# EAGLE design efm32core (EAGLE 6.5.0)
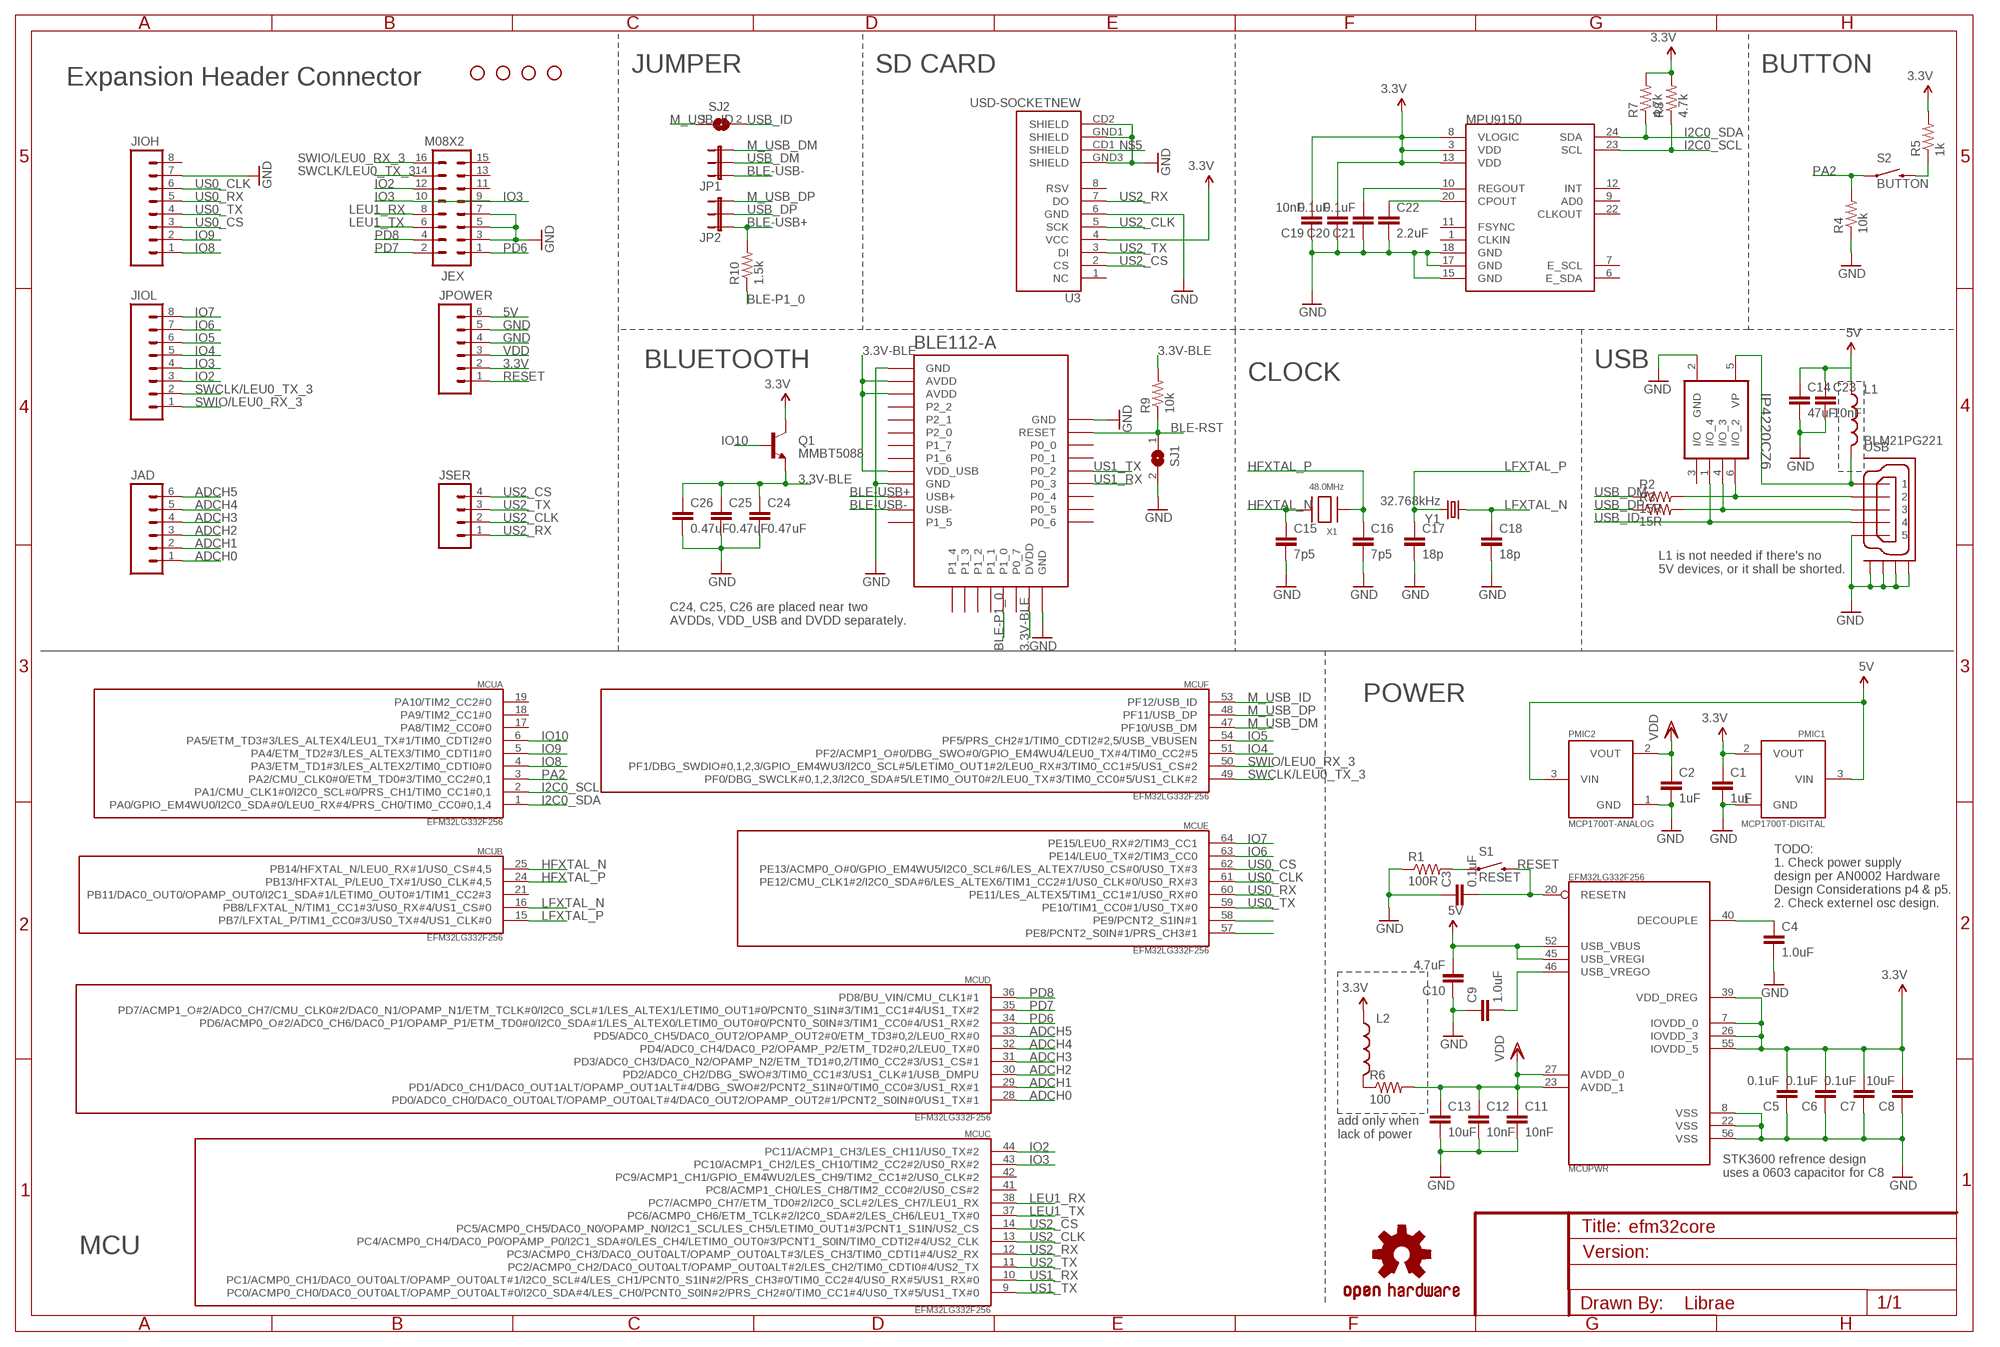
[diagram p0: schematic, sheet 1]

## Parts
BLE112-A  SF-BLUEGIGA_BLE112-A-VISUAL  [SF-BLUEGIGA_BLE112-A]
C1  1uF  10UF-6.3V-20%(1206)  [1206]
C2  1uF  10UF-6.3V-20%(1206)  [1206]
C3  0.1uF  0.1UF-25V-5%(0603)  [0603-CAP]
C4  1.0uF  1.0UF-16V-10%(0603)  [0603-CAP]
C5  0.1uF  0.1UF-25V-5%(0603)  [0603-CAP]
C6  0.1uF  0.1UF-25V-5%(0603)  [0603-CAP]
C7  0.1uF  0.1UF-25V-5%(0603)  [0603-CAP]
C8  10uF  10UF-6.3V-20%(1206)  [1206]
C9  1.0uF  1.0UF-16V-10%(0603)  [0603-CAP]
C10  4.7uF  4.7UF-6.3V-10%(0603)0603  [0603-CAP]
C11  10nF  10NF/10000PF-50V-10%(0603)  [0603-CAP]
C12  10nF  10NF/10000PF-50V-10%(0603)  [0603-CAP]
C13  10uF  10UF-6.3V-20%(1206)  [1206]
C14  47uF  10UF-6.3V-20%(1206)  [1206]
C15  7p5  9.0PF-50V-10%(0603)  [0603-CAP]
C16  7p5  9.0PF-50V-10%(0603)  [0603-CAP]
C17  18p  9.0PF-50V-10%(0603)  [0603-CAP]
C18  18p  9.0PF-50V-10%(0603)  [0603-CAP]
C19  10nF  10NF/10000PF-50V-10%(0603)  [0603-CAP]
C20  0.1uF  0.1UF-25V(+80/-20%)(0603)  [0603-CAP]
C21  0.1uF  0.1UF-25V(+80/-20%)(0603)  [0603-CAP]
C22  2.2uF  2.2UF-10V-20%(0603)  [0603-CAP]
C23  10nF  10NF/10000PF-50V-10%(0603)  [0603-CAP]
C24  0.47uF  10NF/10000PF-50V-10%(0603)  [0603-CAP]
C25  0.47uF  10NF/10000PF-50V-10%(0603)  [0603-CAP]
C26  0.47uF  10NF/10000PF-50V-10%(0603)  [0603-CAP]
IP4220CZ6  IP4220CZ6SSOT-6  [SOT95P275X110-6N]
JAD  M06SIP  [1X06]
JEX  M08X2  [2X8]
JIOH  M081X08  [1X08]
JIOL  M081X08  [1X08]
JP1  JUMPER-3SMD  [SJ_3]
JP2  JUMPER-3SMD  [SJ_3]
JPOWER  M06SIP  [1X06]
JSER  M041.27MM  [1X04-1.27MM]
L1  BLM21PG221  INDUCTOR0805  [0805]
L2  INDUCTOR0603  [0603]
LOGO1  OSHW-LOGOL  [OSHW-LOGO-L]
MCU  EFM32LG332F256  [QFP64]
MPU9150  MPU-9150QFN-24-NP  [QFN-24-NP]
PMIC1  MCP1700T-DIGITAL  MCP1700T  [SOT23]
PMIC2  MCP1700T-ANALOG  MCP1700T  [SOT23]
Q1  MMBT5088  TRANSISTOR_NPNMMBT5088  [SOT23]
R1  100R  100OHM1/10W1%(0603)  [0603-RES]
R2  15R  100-1%  [0603-RES]
R3  15R  100-1%  [0603-RES]
R4  10k  100OHM1/10W1%(0603)  [0603-RES]
R5  1k  100OHM1/10W1%(0603)  [0603-RES]
R6  100  100OHM1/10W1%(0603)  [0603-RES]
R7  4.7k  100OHM1/10W1%(0603)  [0603-RES]
R8  4.7k  100OHM1/10W1%(0603)  [0603-RES]
R9  10k  100-1%  [0603-RES]
R10  1.5k  100-1%  [0603-RES]
S1  RESET  PIXHAWK2_SWITCH-MOMENTARY-2  [PIXHAWK2_EVQP7J01K]
S2  BUTTON  PIXHAWK2_SWITCH-MOMENTARY-2  [PIXHAWK2_EVQP7J01K]
SJ1  JUMPER_SJ  [JUMPER_SJ]
SJ2  JUMPER_SJ  [JUMPER_SJ]
STANDOFF1  STAND-OFF  [STAND-OFF]
STANDOFF2  STAND-OFF  [STAND-OFF]
STANDOFF3  STAND-OFF  [STAND-OFF]
STANDOFF4  STAND-OFF  [STAND-OFF]
U3  USD-SOCKETNEW  [MICRO-SD-SOCKET-PP]
USB  PIXHAWK2_MOLEX-47346-0001  [PIXHAWK2_MOLEX-47346-0001]
X1  48.0MHz  XTALNX5032  [NX5032]
Y1  32.768kHz  CRYSTAL5X1.5  [CRYSTAL-32KHZ-SMD-MS3V-T1R]

## Nets
1: IP4220CZ6.5(VP) L1.2 USB.VBUS
3.3V: C1.1 C5.2 C6.2 C7.2 C8.2 C19.2 C20.2 JPOWER.2 L2.1 MCU.7(PWR:IOVDD_0) MCU.26(PWR:IOVDD_3) MCU.39(PWR:VDD_DREG) MCU.55(PWR:IOVDD_5) MPU9150.3(VDD) MPU9150.8(VLOGIC) MPU9150.13(VDD) PMIC1.2(VOUT) Q1.3(C) R5.2 R7.2 R8.2 U3.4(VCC)
3.3V-BLE: BLE112-A.AVDD1(AVDD) BLE112-A.AVDD2(AVDD) BLE112-A.DVDD BLE112-A.VDD_USB C24.1 C25.1 C26.1 Q1.2(E) R9.2
5V: C10.2 C14.1 C23.1 JPOWER.6 L1.1 MCU.45(PWR:USB_VREGI) MCU.52(PWR:USB_VBUS) PMIC1.3(VIN) PMIC2.3(VIN)
ADCH0: JAD.1 MCU.28(D:PD0/ADC0_CH0/DAC0_OUT0ALT/OPAMP_OUT0ALT#4/DAC0_OUT2/OPAMP_OUT2#1/PCNT2_S0IN#0/US1_TX#1)
ADCH1: JAD.2 MCU.29(D:PD1/ADC0_CH1/DAC0_OUT1ALT/OPAMP_OUT1ALT#4/DBG_SWO#2/PCNT2_S1IN#0/TIM0_CC0#3/US1_RX#1)
ADCH2: JAD.3 MCU.30(D:PD2/ADC0_CH2/DBG_SWO#3/TIM0_CC1#3/US1_CLK#1/USB_DMPU)
ADCH3: JAD.4 MCU.31(D:PD3/ADC0_CH3/DAC0_N2/OPAMP_N2/ETM_TD1#0,2/TIM0_CC2#3/US1_CS#1)
ADCH4: JAD.5 MCU.32(D:PD4/ADC0_CH4/DAC0_P2/OPAMP_P2/ETM_TD2#0,2/LEU0_TX#0)
ADCH5: JAD.6 MCU.33(D:PD5/ADC0_CH5/DAC0_OUT2/OPAMP_OUT2#0/ETM_TD3#0,2/LEU0_RX#0)
BLE-P1_0: BLE112-A.P1_0 R10.1
BLE-RST: BLE112-A.RESET R9.1 SJ1.1
BLE-USB+: BLE112-A.USB+ JP2.1 R10.2
BLE-USB-: BLE112-A.USB- JP1.1
GND: BLE112-A.GND1(GND) BLE112-A.GND2(GND) BLE112-A.GND3(GND) BLE112-A.GND4(GND) C1.2 C2.2 C3.1 C4.2 C5.1 C6.1 C7.1 C8.1 C9.1 C10.1 C11.2 C12.2 C13.2 C14.2 C15.2 C16.2 C17.2 C18.2 C19.1 C20.1 C21.1 C22.2 C23.2 C24.2 C25.2 C26.2 IP4220CZ6.2(GND) JEX.3 JEX.5 JEX.7 JIOH.7 JPOWER.4 JPOWER.5 MCU.8(PWR:VSS) MCU.22(PWR:VSS) MCU.56(PWR:VSS) MPU9150.15(GND) MPU9150.17(GND) MPU9150.18(GND) PMIC1.1(GND) PMIC2.1(GND) R1.1 R4.1 SJ1.2 U3.6(GND) U3.CD2(SHIELD) U3.GND1(SHIELD) U3.GND3(SHIELD) USB.GND USB.GND1 USB.GND2 USB.GND3 USB.GND4
HFXTAL_N: C15.1 MCU.25(B:PB14/HFXTAL_N/LEU0_RX#1/US0_CS#4,5) X1.P$2
HFXTAL_P: C16.1 MCU.24(B:PB13/HFXTAL_P/LEU0_TX#1/US0_CLK#4,5) X1.P$1
I2C0_SCL: MCU.2(A:PA1/CMU_CLK1#0/I2C0_SCL#0/PRS_CH1/TIM0_CC1#0,1) MPU9150.23(SCL) R8.1
I2C0_SDA: MCU.1(A:PA0/GPIO_EM4WU0/I2C0_SDA#0/LEU0_RX#4/PRS_CH0/TIM0_CC0#0,1,4) MPU9150.24(SDA) R7.1
IO2: JEX.12 JIOL.3 MCU.44(C:PC11/ACMP1_CH3/LES_CH11/US0_TX#2)
IO3: JEX.9 JEX.10 JIOL.4 MCU.43(C:PC10/ACMP1_CH2/LES_CH10/TIM2_CC2#2/US0_RX#2)
IO4: JIOL.5 MCU.51(F:PF2/ACMP1_O#0/DBG_SWO#0/GPIO_EM4WU4/LEU0_TX#4/TIM0_CC2#5)
IO5: JIOL.6 MCU.54(F:PF5/PRS_CH2#1/TIM0_CDTI2#2,5/USB_VBUSEN)
IO6: JIOL.7 MCU.63(E:PE14/LEU0_TX#2/TIM3_CC0)
IO7: JIOL.8 MCU.64(E:PE15/LEU0_RX#2/TIM3_CC1)
IO8: JIOH.1 MCU.4(A:PA3/ETM_TD1#3/LES_ALTEX2/TIM0_CDTI0#0)
IO9: JIOH.2 MCU.5(A:PA4/ETM_TD2#3/LES_ALTEX3/TIM0_CDTI1#0)
IO10: MCU.6(A:PA5/ETM_TD3#3/LES_ALTEX4/LEU1_TX#1/TIM0_CDTI2#0) Q1.1(B)
LEU1_RX: JEX.8 MCU.38(C:PC7/ACMP0_CH7/ETM_TD0#2/I2C0_SCL#2/LES_CH7/LEU1_RX)
LEU1_TX: JEX.6 MCU.37(C:PC6/ACMP0_CH6/ETM_TCLK#2/I2C0_SDA#2/LES_CH6/LEU1_TX#0)
LFXTAL_N: C18.1 MCU.16(B:PB8/LFXTAL_N/TIM1_CC1#3/US0_RX#4/US1_CS#0) Y1.X1
LFXTAL_P: C17.1 MCU.15(B:PB7/LFXTAL_P/TIM1_CC0#3/US0_TX#4/US1_CLK#0) Y1.X2
M_USB_DM: JP1.3 MCU.47(F:PF10/USB_DM)
M_USB_DP: JP2.3 MCU.48(F:PF11/USB_DP)
M_USB_ID: MCU.53(F:PF12/USB_ID) SJ2.1
N$4: L2.2 R6.1
N$5: U3.CD1(SHIELD)
N$6: R1.2 S1.A1
N$7: C4.1 MCU.40(PWR:DECOUPLE)
N$8: C9.2 MCU.46(PWR:USB_VREGO)
N$9: R5.1 S2.B3
N$11: MCU.57(E:PE8/PCNT2_S0IN#1/PRS_CH3#1)
N$12: C21.2 MPU9150.10(REGOUT)
N$13: IP4220CZ6.4(I/O_3) R3.2 USB.D+
N$14: IP4220CZ6.6(I/O_2) R2.2 USB.D-
N$15: C22.1 MPU9150.20(CPOUT)
N$16: MCU.58(E:PE9/PCNT2_S1IN#1)
PA2: MCU.3(A:PA2/CMU_CLK0#0/ETM_TD0#3/TIM0_CC2#0,1) R4.2 S2.A1
PD6: JEX.1 MCU.34(D:PD6/ACMP0_O#2/ADC0_CH6/DAC0_P1/OPAMP_P1/ETM_TD0#0/I2C0_SDA#1/LES_ALTEX0/LETIM0_OUT0#0/PCNT0_S0IN#3/TIM1_CC0#4/US1_RX#2)
PD7: JEX.2 MCU.35(D:PD7/ACMP1_O#2/ADC0_CH7/CMU_CLK0#2/DAC0_N1/OPAMP_N1/ETM_TCLK#0/I2C0_SCL#1/LES_ALTEX1/LETIM0_OUT1#0/PCNT0_S1IN#3/TIM1_CC1#4/US1_TX#2)
PD8: JEX.4 MCU.36(D:PD8/BU_VIN/CMU_CLK1#1)
RESET: C3.2 JPOWER.1 MCU.20(PWR:RESETN) S1.B3
SWCLK/LEU0_TX_3: JEX.14 JIOL.2 MCU.49(F:PF0/DBG_SWCLK#0,1,2,3/I2C0_SDA#5/LETIM0_OUT0#2/LEU0_TX#3/TIM0_CC0#5/US1_CLK#2)
SWIO/LEU0_RX_3: JEX.16 JIOL.1 MCU.50(F:PF1/DBG_SWDIO#0,1,2,3/GPIO_EM4WU3/I2C0_SCL#5/LETIM0_OUT1#2/LEU0_RX#3/TIM0_CC1#5/US1_CS#2)
US0_CLK: JIOH.6 MCU.61(E:PE12/CMU_CLK1#2/I2C0_SDA#6/LES_ALTEX6/TIM1_CC2#1/US0_CLK#0/US0_RX#3)
US0_CS: JIOH.3 MCU.62(E:PE13/ACMP0_O#0/GPIO_EM4WU5/I2C0_SCL#6/LES_ALTEX7/US0_CS#0/US0_TX#3)
US0_RX: JIOH.5 MCU.60(E:PE11/LES_ALTEX5/TIM1_CC1#1/US0_RX#0)
US0_TX: JIOH.4 MCU.59(E:PE10/TIM1_CC0#1/US0_TX#0)
US1_RX: BLE112-A.P0_3 MCU.10(C:PC1/ACMP0_CH1/DAC0_OUT0ALT/OPAMP_OUT0ALT#1/I2C0_SCL#4/LES_CH1/PCNT0_S1IN#2/PRS_CH3#0/TIM0_CC2#4/US0_RX#5/US1_RX#0)
US1_TX: BLE112-A.P0_2 MCU.9(C:PC0/ACMP0_CH0/DAC0_OUT0ALT/OPAMP_OUT0ALT#0/I2C0_SDA#4/LES_CH0/PCNT0_S0IN#2/PRS_CH2#0/TIM0_CC1#4/US0_TX#5/US1_TX#0)
US2_CLK: JSER.2 MCU.13(C:PC4/ACMP0_CH4/DAC0_P0/OPAMP_P0/I2C1_SDA#0/LES_CH4/LETIM0_OUT0#3/PCNT1_S0IN/TIM0_CDTI2#4/US2_CLK) U3.5(SCK)
US2_CS: JSER.4 MCU.14(C:PC5/ACMP0_CH5/DAC0_N0/OPAMP_N0/I2C1_SCL/LES_CH5/LETIM0_OUT1#3/PCNT1_S1IN/US2_CS) U3.2(CS)
US2_RX: JSER.1 MCU.12(C:PC3/ACMP0_CH3/DAC0_OUT0ALT/OPAMP_OUT0ALT#3/LES_CH3/TIM0_CDTI1#4/US2_RX) U3.7(DO)
US2_TX: JSER.3 MCU.11(C:PC2/ACMP0_CH2/DAC0_OUT0ALT/OPAMP_OUT0ALT#2/LES_CH2/TIM0_CDTI0#4/US2_TX) U3.3(DI)
USB_DM: JP1.2 R2.1
USB_DP: JP2.2 R3.1
USB_ID: IP4220CZ6.1(I/O_4) SJ2.2 USB.ID
VDD: C2.1 C11.1 C12.1 C13.1 JPOWER.3 MCU.23(PWR:AVDD_1) MCU.27(PWR:AVDD_0) PMIC2.2(VOUT) R6.2
Unconnected: BLE112-A.P0_0 BLE112-A.P0_1 BLE112-A.P0_4 BLE112-A.P0_5 BLE112-A.P0_6 BLE112-A.P0_7 BLE112-A.P1_1 BLE112-A.P1_2 BLE112-A.P1_3 BLE112-A.P1_4 BLE112-A.P1_5 BLE112-A.P1_6 BLE112-A.P1_7 BLE112-A.P2_0 BLE112-A.P2_1 BLE112-A.P2_2 IP4220CZ6.3(I/O) JEX.11 JEX.13 JEX.15 JIOH.8 MCU.17(A:PA8/TIM2_CC0#0) MCU.18(A:PA9/TIM2_CC1#0) MCU.19(A:PA10/TIM2_CC2#0) MCU.21(B:PB11/DAC0_OUT0/OPAMP_OUT0/I2C1_SDA#1/LETIM0_OUT0#1/TIM1_CC2#3) MCU.41(C:PC8/ACMP1_CH0/LES_CH8/TIM2_CC0#2/US0_CS#2) MCU.42(C:PC9/ACMP1_CH1/GPIO_EM4WU2/LES_CH9/TIM2_CC1#2/US0_CLK#2) MPU9150.1(CLKIN) MPU9150.6(E_SDA) MPU9150.7(E_SCL) MPU9150.9(AD0) MPU9150.11(FSYNC) MPU9150.12(INT) MPU9150.22(CLKOUT) U3.1(NC) U3.8(RSV)

## Notes on the sheet
- JUMPER | SD CARD | BUTTON
- Expansion Header Connector
- BLUETOOTH | USB
- CLOCK
- L1 is not needed if there's no
  5V devices, or it shall be shorted.
- C24, C25, C26 are placed near two
  AVDDs, VDD_USB and DVDD separately.
- POWER
- TODO:
  1. Check power supply
  design per AN0002 Hardware 
  Design Considerations p4 & p5.
  2. Check externel osc design.
- add only when
  lack of power
- STK3600 refrence design
  uses a 0603 capacitor for C8
- MCU
- Librae

## Library data of the parts
BLE112-A = BLE112-Breakout-Board-v2.1:SF-BLUEGIGA_BLE112-A-VISUAL: Bluetooth Low Energy single-mode module - Bluetooth 4.0, chip antenna
C1 C2 C14 = SparkFun-Capacitors:10UF-6.3V-20%(1206): Ceramic CAP-10057; PROD_ID: CAP-10057; VALUE: 10uF
C3 C5-C7 = SparkFun-Capacitors:0.1UF-25V-5%(0603): CAP-08604; PROD_ID: CAP-08604
C4 C9 = SparkFun-Capacitors:1.0UF-16V-10%(0603): CAP-00868; PROD_ID: CAP-00868
C8 C13 = SparkFun-Capacitors:10UF-6.3V-20%(1206): Ceramic CAP-10057; PROD_ID: CAP-10057
C10 = SparkFun-Capacitors:4.7UF-6.3V-10%(0603): CAP-08280; PROD_ID: CAP-08280
C11 C12 C19 C23 = SparkFun-Capacitors:10NF/10000PF-50V-10%(0603): CAP-00867; PROD_ID: CAP-00867
C15-C18 = SparkFun-Capacitors:9.0PF-50V-10%(0603): CAP-09341; PROD_ID: CAP-09341; VALUE: 9.0pF
C20 C21 = SparkFun-Capacitors:0.1UF-25V(+80/-20%)(0603): Ceramic Standard decoupling cap CAP-00810; PROD_ID: CAP-00810
C22 = SparkFun-Capacitors:2.2UF-10V-20%(0603): CAP-07888; PROD_ID: CAP-07888
C24-C26 = SparkFun-Capacitors:10NF/10000PF-50V-10%(0603): CAP-00867; PROD_ID: CAP-00867; VALUE: 10nF
IP4220CZ6 = FT232H-basic:IP4220CZ6: Dual Schmitt-Trigger Inverter; MPN: IP4220CZ6; OC_FARNELL: 1506629; OC_NEWARK: 61M6815; PACKAGE: SSOT-6; SUPPLIER: NXP
JAD JPOWER = SparkFun-Connectors:M06: Header 6 Standard 6-pin 0.1" header. Use with straight break away headers (SKU : PRT-00116), right angle break away headers (PRT-00553), swiss pins (PRT-00743), machine pins (PRT-00117), and female headers (PRT-00115). Molex polarized connector foot print use with SKU : PRT-08094 with associated crimp pins and housings. NOTES ON THE VARIANTS LOCK and LOCK_LONGPADS... This footprint was designed to help hold the alignment of a through-hole component (i.e. 6-pin header) while soldering it into place. You may notice that each hole has been shifted either up or down by 0.005 of an inch from it's more standard position (which is a perfectly straight line). This slight alteration caused the pins (the squares in the middle) to touch the edges of the holes. Because they are alternating, it causes a "brace" to hold the component in place. 0.005 has proven to be the perfect amount of "off-center" position when using our standard breakaway headers. Although looks a little odd when you look at the bare footprint, once you have a header in there, the alteration is very hard to notice. Also,if you push a header all the way into place, it is covered up entirely on the bottom side. This idea of altering the position of holes to aid alignment will be further integrated into the Sparkfun Library for other footprints. It can help hold any component with 3 or more connection pins.
JEX = SparkFun-Connectors:M08X2: .1" headers, two rows of 8 each
JIOH JIOL = SparkFun-Connectors:M08: Header 8 Standard 8-pin 0.1" header. Use with straight break away headers (SKU : PRT-00116), right angle break away headers (PRT-00553), swiss pins (PRT-00743), machine pins (PRT-00117), and female headers (PRT-00115).
JP1 JP2 = SparkFun-Passives:JUMPER-3
JSER = SparkFun-Connectors:M04: Header 4 Standard 4-pin 0.1" header. Use with straight break away headers (SKU : PRT-00116), right angle break away headers (PRT-00553), swiss pins (PRT-00743), machine pins (PRT-00117), and female headers (PRT-00115). Molex polarized connector foot print use with SKU : PRT-08231 with associated crimp pins and housings. 1MM SMD Version SKU: PRT-10208
L1 L2 = SparkFun-Passives:INDUCTOR: Inductors Basic Inductor/Choke - 0603 and 1206. Footprints are not proven and vary greatly between part numbers. SRN6045- 33uH, 20% 1.4A SDR0403-560KL - 56uH, 10%, 500mA RMS/740mA peak
LOGO1 = SparkFun-Aesthetics:OSHW-LOGO: Open Source Hardware Logo This logo indicates the piece of hardware it is found on incorporates a OSHW license and/or adheres to the definition of open source hardware found here: http://freedomdefined.org/OSHW
MCU = EnergyMicro:EFM32LG332F256: EFM32LG332F256 Leopard Microcontroller in 10mm x 10mm QFP64 package
MPU9150 = SparkFun-Sensors:MPU-9150: 9DOF (3mag, 3accel, 3rotat). I2C interface.
PMIC1 PMIC2 = maple-r5:MCP1700T
Q1 = SparkFun-DiscreteSemi:TRANSISTOR_NPN: Generic NPN BJT MMBT2222A - TRANS-08049 (SOT-23, 1A 40V) MPSA42 - TRANS-09116 (SOT-23, 500mA 300V) MMBT5088LT1G - TRANS-11160 (SOT-23, 50 mA 30V); PROD_ID: TRANS-11160
R1 R4 R5 R7 R8 = SparkFun-Resistors:100OHM1/10W1%(0603): RES-07863; PROD_ID: RES-07863; VALUE: 100
R2 R3 R9 R10 = SparkFun-Resistors:100-1%: 100-ohm SMT 1/10W - 1% (0603) RES-07863; PROD_ID: RES-07863; VALUE: 100
R6 = SparkFun-Resistors:100OHM1/10W1%(0603): RES-07863; PROD_ID: RES-07863
S1 S2 = PX4FMUv1.7.1:PIXHAWK2_SWITCH-MOMENTARY-2
SJ1 SJ2 = BLE112-Breakout-Board-v2.1:JUMPER_SJ: SMD solder JUMPER
STANDOFF1-STANDOFF4 = SparkFun-Electromechanical:STAND-OFF: #4 Stand Off This is the mechanical footprint for a #4 phillips button head screw. Use the keepout ring to avoid running the screw head into surrounding components. SKU : PRT-00447
U3 = SparkFun-Connectors:USD-SOCKET: microSD Socket Push-push type uSD socket. Schematic element and footprint production proven. Spark Fun Electronics SKU : PRT-00127. tDoc lines correctly indicate media card edge positions when inserting (unlocked, locked, depressed).
USB = PX4FMUv1.7.1:PIXHAWK2_MOLEX-47346-0001: MICRO USB B, BOTTOM MOUNT
X1 = adafruit:XTAL: Low cost SMT crystals, no capacitors included http://www.ladyada.net/library/eagle
Y1 = SparkFun-FreqCtrl:CRYSTAL: Various standard crystals. Proven footprints. Spark Fun Electronics SKU : COM-00534

## Board
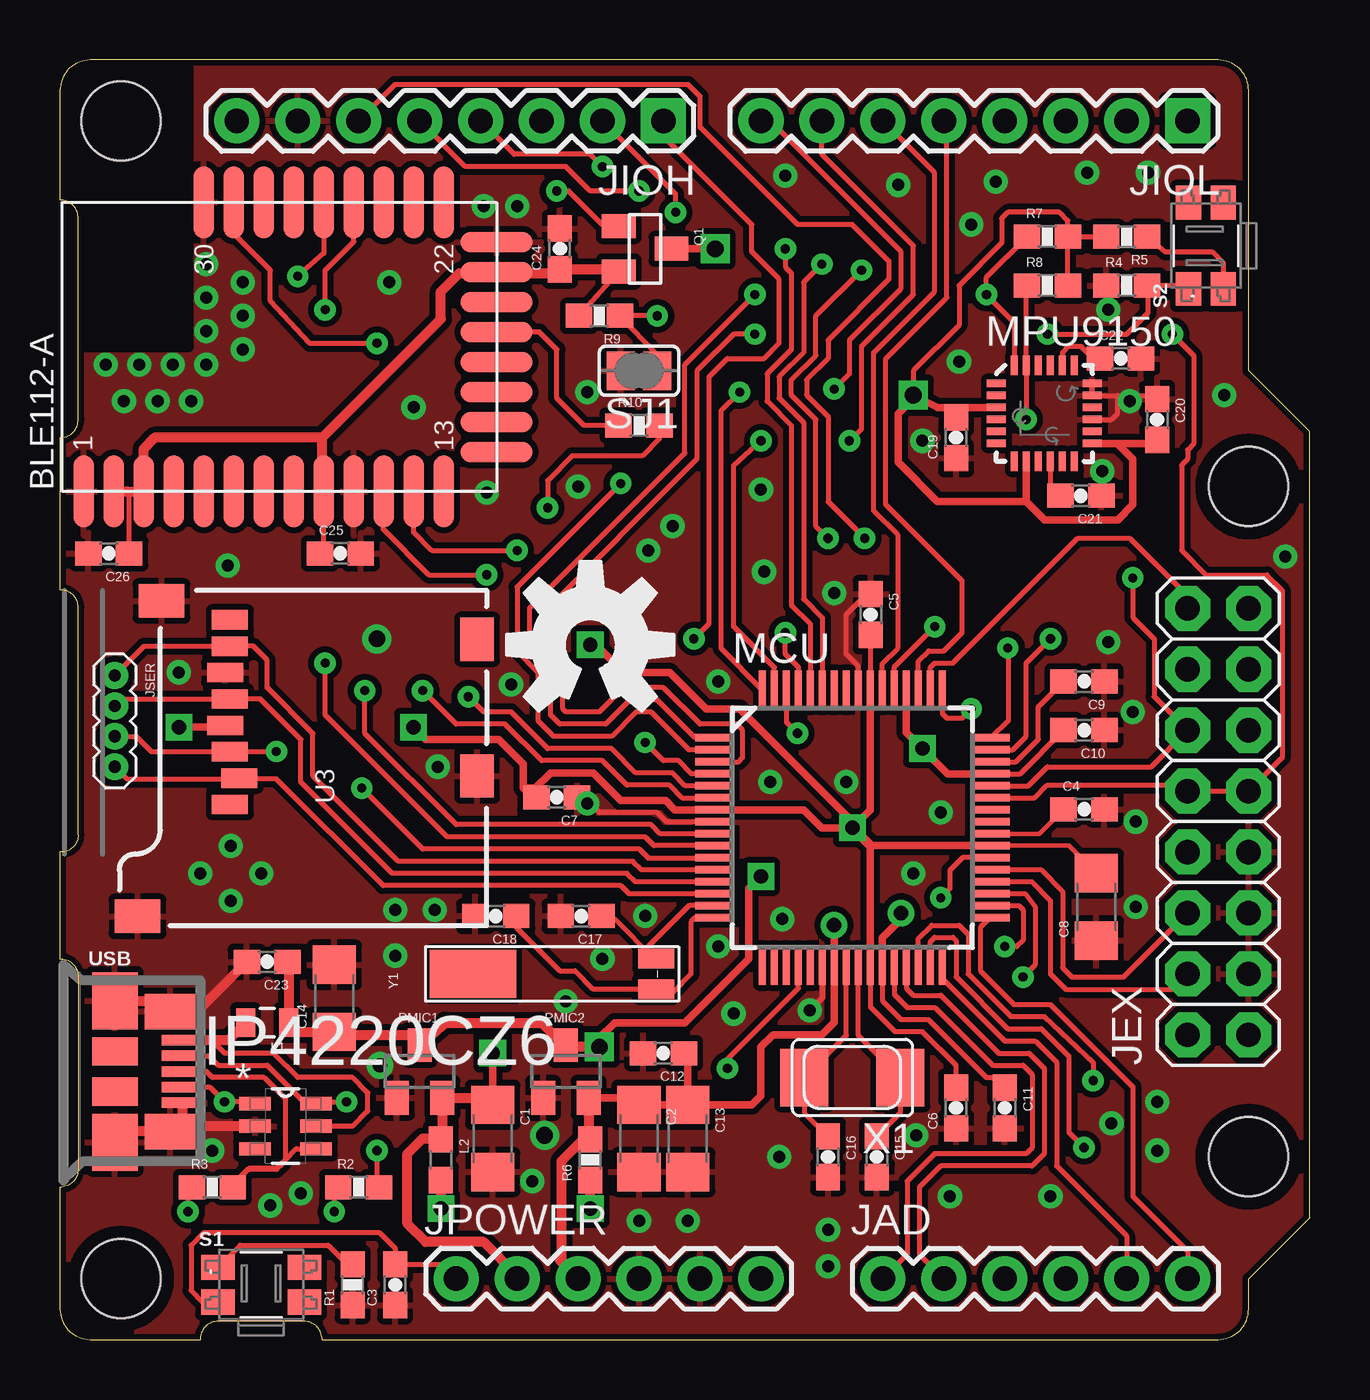
[diagram p1: board, top side]
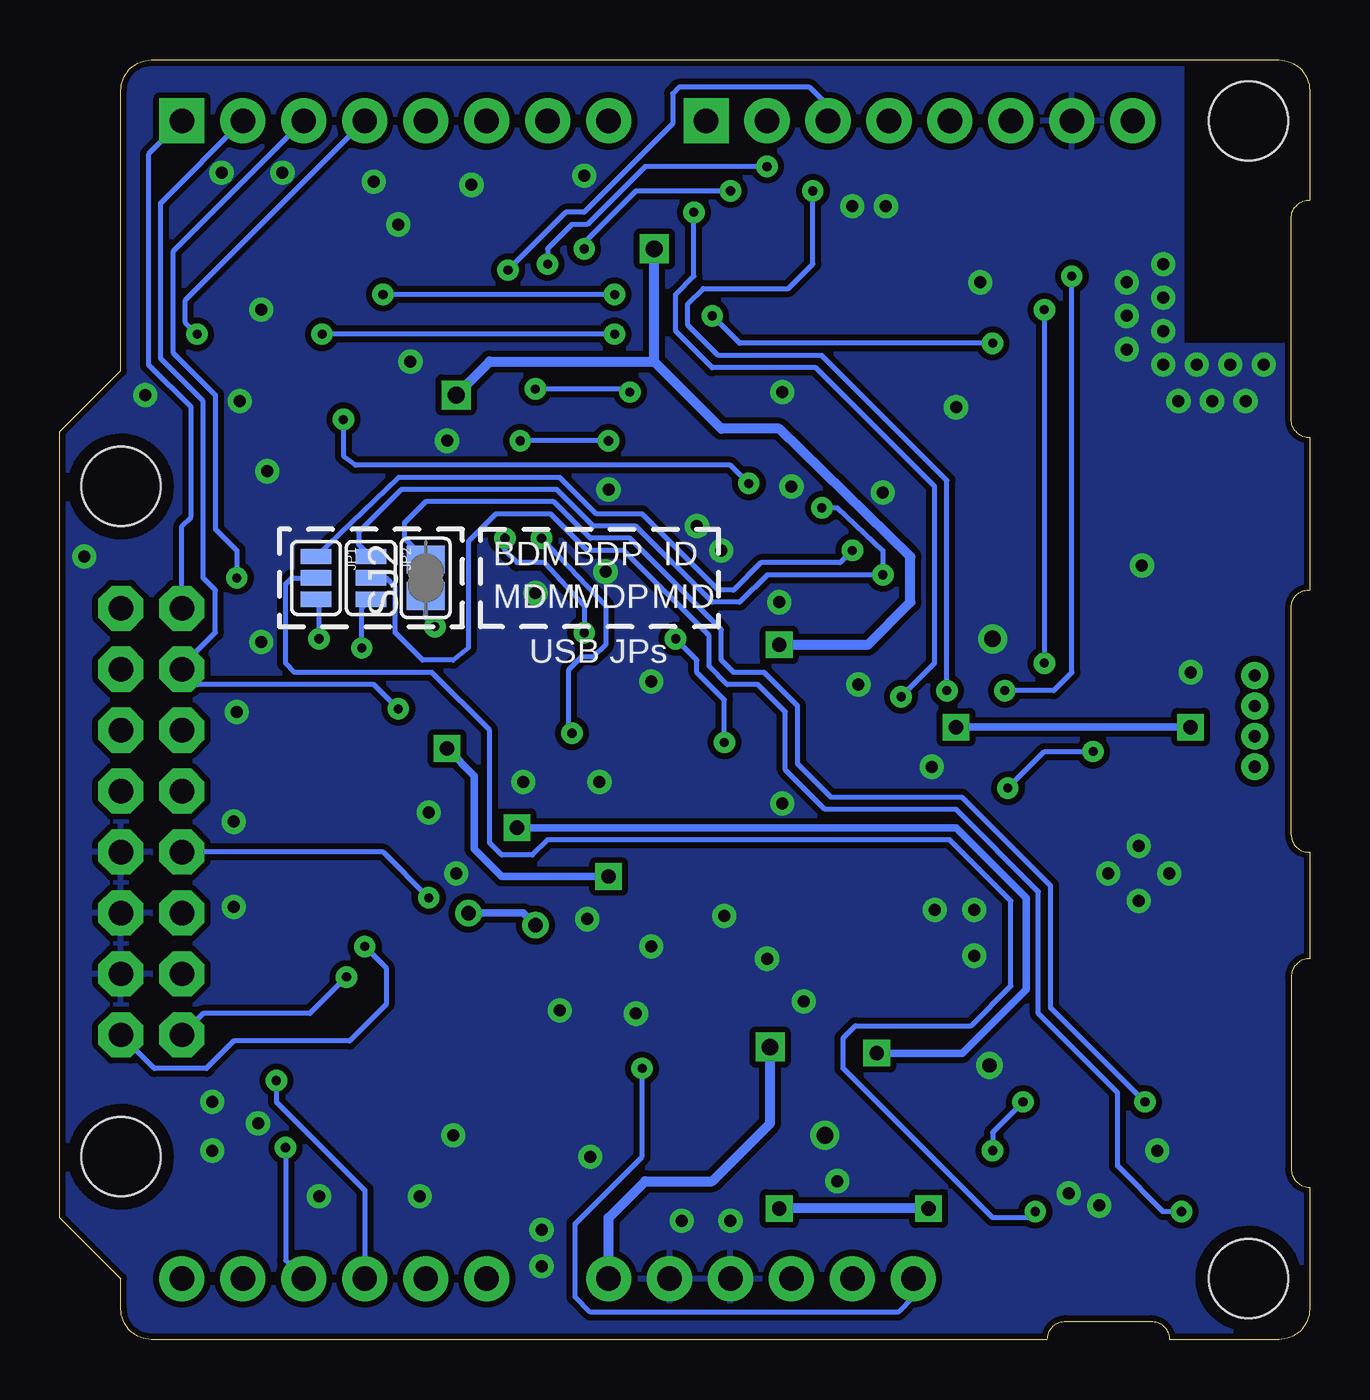
[diagram p2: board, bottom side, seen from below]

Size 52.07 x 53.34 mm. Coordinates in mm from the lower left corner, seen from the top.
Outline: 0,6.35 0,1.27 arc90 1.27,0 5.84,0 arc-90 6.6,0.76 10.16,0.76 arc-90 10.92,0 48.26,0 arc90 49.53,1.27 49.53,2.54 52.07,5.08 52.07,37.85 49.53,40.39 49.53,52.07 arc90 48.26,53.34 1.27,53.34 arc90 0,52.07 0,47.5 arc-90 0.76,46.74 0.76,38.35 arc-90 0,37.59 0,31.24 0.04,31.24 arc-90 0.76,30.52 0.76,21.04 arc-90 0.04,20.32 0,20.32 0,15.88 arc-90 0.76,15.11 0.76,7.11 arc-90 0,6.35
Copper layers (1*16): Top 0.035mm / dielectric 1.5mm / Bottom 0.035mm
Design rules "SparkFun-2-layer": minimum track width 7mil, minimum drill 15mil, track to track 8mil, track to pad 8mil, pad to pad 8mil, via to via 8mil, smd to smd 8mil, copper to edge 8mil, drill to drill 8mil, minimum pad ring 12mil, minimum via ring 10mil, stop-mask expansion 4mil, vias tented up to drill 20mil, thermal gap 10mil
tRestrict: area 0,41.4 to 5.3,53.3

### Footprints (pad centres in the part's own frame; a part is rotated, then mirrored left to right if it is on the bottom)
SF-BLUEGIGA_BLE112-A = smd 3 x 0.85: AVDD1 -6.05,6.9; AVDD2 -6.05,5.65; GND1 -6.05,8.15; GND2 -6.05,-3.1; GND4 6,3.15; P0_0 6,0.65; P0_1 6,-0.6; P0_2 6,-1.85; P0_3 6,-3.1; P0_4 6,-4.35; P0_5 6,-5.6; P0_6 6,-6.85; P1_5 -6.05,-6.85; P1_6 -6.05,-0.6; P1_7 -6.05,0.65; P2_0 -6.05,1.9; P2_1 -6.05,3.15; P2_2 -6.05,4.4; RESET 6,1.9; USB+ -6.05,-4.35; USB- -6.05,-5.6; VDD_USB -6.05,-1.85 | smd 0.85 x 3: DVDD 3.1,-9.05; GND3 4.35,-9.05; P0_7 1.85,-9.05; P1_0 0.6,-9.05; P1_1 -0.65,-9.05; P1_2 -1.9,-9.05; P1_3 -3.15,-9.05; P1_4 -4.4,-9.05
1206 = smd 1.6 x 1.8: 1 -1.4,0; 2 1.4,0
0603-CAP = smd 1.1 x 1: 1 -0.85,0; 2 0.85,0
SOT95P275X110-6N = smd 1.321 x 0.559: 1 -1.27,0.94; 2 -1.27,0; 3 -1.27,-0.94; 4 1.27,-0.94; 5 1.27,0; 6 1.27,0.94
1X06 = drill 1.016 pad 1.88: 1 0,0; 2 2.54,0; 3 5.08,0; 4 7.62,0; 5 10.16,0; 6 12.7,0
2X8 = drill 1.016 pad 1.88 octagon: 1 0,0; 2 0,2.54; 3 2.54,0; 4 2.54,2.54; 5 5.08,0; 6 5.08,2.54; 7 7.62,0; 8 7.62,2.54; 9 10.16,0; 10 10.16,2.54; 11 12.7,0; 12 12.7,2.54; 13 15.24,0; 14 15.24,2.54; 15 17.78,0; 16 17.78,2.54
1X08 = drill 1.016 pad 1.88 square: 1 0,0 | drill 1.016 pad 1.88: 2 2.54,0; 3 5.08,0; 4 7.62,0; 5 10.16,0; 6 12.7,0; 7 15.24,0; 8 17.78,0
SJ_3 = smd 0.635 x 1.27: 1 -0.889,0; 2 0,0; 3 0.889,0
1X04-1.27MM = drill 0.508 pad 1: 1 0,0; 2 1.27,0; 3 2.54,0; 4 3.81,0
0805 = smd 0.8 x 1.2: 1 -0.9,0; 2 0.9,0
0603 = smd 1.1 x 1: 1 -0.85,0; 2 0.85,0
QFP64 = smd 1.6 x 0.3: 1 -5.75,3.75; 2 -5.75,3.25; 3 -5.75,2.75; 4 -5.75,2.25; 5 -5.75,1.75; 6 -5.75,1.25; 7 -5.75,0.75; 8 -5.75,0.25; 9 -5.75,-0.25; 10 -5.75,-0.75; 11 -5.75,-1.25; 12 -5.75,-1.75; 13 -5.75,-2.25; 14 -5.75,-2.75; 15 -5.75,-3.25; 16 -5.75,-3.75; 33 5.75,-3.75; 34 5.75,-3.25; 35 5.75,-2.75; 36 5.75,-2.25; 37 5.75,-1.75; 38 5.75,-1.25; 39 5.75,-0.75; 40 5.75,-0.25; 41 5.75,0.25; 42 5.75,0.75; 43 5.75,1.25; 44 5.75,1.75; 45 5.75,2.25; 46 5.75,2.75; 47 5.75,3.25; 48 5.75,3.75 | smd 0.3 x 1.6: 17 -3.75,-5.75; 18 -3.25,-5.75; 19 -2.75,-5.75; 20 -2.25,-5.75; 21 -1.75,-5.75; 22 -1.25,-5.75; 23 -0.75,-5.75; 24 -0.25,-5.75; 25 0.25,-5.75; 26 0.75,-5.75; 27 1.25,-5.75; 28 1.75,-5.75; 29 2.25,-5.75; 30 2.75,-5.75; 31 3.25,-5.75; 32 3.75,-5.75; 49 3.75,5.75; 50 3.25,5.75; 51 2.75,5.75; 52 2.25,5.75; 53 1.75,5.75; 54 1.25,5.75; 55 0.75,5.75; 56 0.25,5.75; 57 -0.25,5.75; 58 -0.75,5.75; 59 -1.25,5.75; 60 -1.75,5.75; 61 -2.25,5.75; 62 -2.75,5.75; 63 -3.25,5.75; 64 -3.75,5.75
QFN-24-NP = smd 0.8 x 0.3: 1 -2,1.25; 2 -2,0.75; 3 -2,0.25; 4 -2,-0.25; 5 -2,-0.75; 6 -2,-1.25; 13 2,-1.25; 14 2,-0.75; 15 2,-0.25; 16 2,0.25; 17 2,0.75; 18 2,1.25 | smd 0.3 x 0.8: 7 -1.25,-2; 8 -0.75,-2; 9 -0.25,-2; 10 0.25,-2; 11 0.75,-2; 12 1.25,-2; 19 1.25,2; 20 0.75,2; 21 0.25,2; 22 -0.25,2; 23 -0.75,2; 24 -1.25,2
SOT23 = smd 1 x 1.4: 1 -0.95,-1.1; 2 0.95,-1.1; 3 0,1.1
0603-RES = smd 1.1 x 1: 1 -0.85,0; 2 0.85,0
PIXHAWK2_EVQP7J01K = smd 1.4 x 1.05: A1 -1.8,0.725; A2 1.8,0.725; B3 -1.8,-0.725; B4 1.8,-0.725
JUMPER_SJ = smd 1.168 x 1.6: 1 -0.762,0; 2 0.762,0
STAND-OFF = hole 3.302: 0,0
MICRO-SD-SOCKET-PP = smd 0.8 x 1.5: 1 -8.94,10.7; 2 -7.84,10.3; 3 -6.74,10.7; 4 -5.64,10.9; 5 -4.54,10.7; 6 -3.44,10.9; 7 -2.34,10.7; 8 -1.24,10.7 | smd 1.8 x 1.4: CD1 -2.05,0.4; CD2 -7.75,0.4 | smd 1.4 x 1.9: GND1 -13.6,14.55; GND3 -0.45,13.55
PIXHAWK2_MOLEX-47346-0001 = smd 1.7 x 0.44: D+ 2.8,0; D- 2.8,0.65; GND 2.8,-1.3; ID 2.8,-0.65; VBUS 2.8,1.3 | smd 1.9 x 2.375: GND1 0,2.95; GND4 0,-2.95 | smd 2.1 x 1.475: GND2 2.3,2.5; GND3 2.3,-2.5 | smd 1.9 x 1.175: GND5 0,-0.838; GND6 0,0.838
NX5032 = smd 2 x 2.4: P$1 2,0; P$2 -2,0
CRYSTAL-32KHZ-SMD-MS3V-T1R = smd 2 x 3.6: SHEILD 0,1.333 | smd 0.8 x 1.5: X1 -0.635,-6.302; X2 0.635,-6.302

### Placement (x,y rotation side)
BLE112-A  9.14,41.4 90 top
C1  18.03,8.38 270 top
C2  24.13,8.38 270 top
C3  13.97,2.29 90 top
C4  42.67,22.1 0 top
C5  33.78,30.23 270 top
C6  37.34,9.65 90 top
C7  20.7,22.61 180 top
C8  43.18,18.03 90 top
C9  42.67,27.43 180 top
C10  42.67,25.4 180 top
C11  39.37,9.65 270 top
C12  25.15,11.94 180 top
C13  26.16,8.38 270 top
C14  11.43,14.22 90 top
C15  34.04,7.62 270 top
C16  32,7.62 270 top
C17  21.72,17.65 180 top
C18  18.16,17.65 180 top
C19  37.34,37.59 90 top
C20  45.72,38.35 270 top
C21  42.55,35.18 180 top
C22  44.2,40.89 0 top
C23  8.64,15.75 180 top
C24  20.83,45.47 90 top
C25  11.68,32.77 0 top
C26  2.03,32.77 180 top
IP4220CZ6  9.4,8.89 0 top
JAD  34.29,2.54 0 top
JEX  49.53,12.7 90 top
JIOH  25.15,50.8 180 top
JIOL  46.99,50.8 180 top
JP1  41.4,31.75 270 bottom
JP2  39.12,31.75 270 bottom
JPOWER  16.51,2.54 0 top
JSER  2.29,27.69 270 top
L1  8.64,13.21 180 top
L2  15.88,7.49 270 top
LOGO1  22.1,28.96 0 top
MCU  33.02,21.34 0 top
MPU9150  41.02,38.61 0 top
PMIC1  14.99,11.18 0 top
PMIC2  21.08,11.18 0 top
Q1  24.38,45.47 270 top
R1  12.19,2.29 90 top
R2  12.45,6.35 0 top
R3  6.35,6.35 0 top
R4  44.45,43.94 0 top
R5  44.45,45.97 180 top
R6  22.1,7.49 90 top
R7  41.15,45.97 0 top
R8  41.15,43.94 0 top
R9  22.48,42.67 180 top
R10  24.13,38.1 0 top
S1  8.38,2.29 0 top
S2  47.75,45.59 90 top
SJ1  24.13,40.39 180 top
SJ2  36.83,31.75 90 bottom
STANDOFF1  2.54,50.8 0 top
STANDOFF2  2.54,2.54 0 top
STANDOFF3  49.53,7.62 0 top
STANDOFF4  49.53,35.56 0 top
U3  17.78,31.24 90 top
USB  2.29,11.18 0 top
X1  33.02,10.92 180 top
Y1  18.54,15.24 90 top

### Tracks (layer width: path | path; a pad name or v marks a point on that pad's centre or on a via)
1
  Top 0.203: IP4220CZ6.5 12.19,8.89 12.83,9.53 12.83,10.29 12.19,10.92 9.91,10.92 8.89,11.94 6.86,11.94 6.32,12.48 USB.VBUS
  Top 0.406: L1.2 7,12.48 USB.VBUS
3.3V  (via drill 0.6, 0.7)
  Top 0.178: C8.2 42.03,20.59 MCU.39 | 15.94,8.4 L2.1
  Top 0.203: C6.2 37.34,11.43 35.94,12.83 34.8,12.83 33.78,13.84 33.78,15.57 MCU.26 | C19.2 37.75,38.86 MPU9150.3 | R5.2 R7.2 R8.2 42,46.65 41.66,46.99 39.5,46.99 39.24,46.74 39.24,45.72 37.47,43.94 37.47,42.29 35.56,40.39 v35.56,39.37 | MCU.55 33.78,27.1 C5.2 | C20.2 45.57,37.36
  Top 0.305: C1.1 v18.03,11.94 | MCU.39 33.77,20.59 MCU.26 | MCU.55 33.77,22.09 v33.02,21.34 | U3.4 6.8,25.53 v4.95,25.53 | Q1.3 v27.3,45.47 | MPU9150.8 40.27,34.94 | MPU9150.13 44.05,37.36 | 44.05,37.36 44.7,36.7 44.7,34.8 44.07,34.16 41.05,34.16 40.27,34.94 | v33.02,21.34 31.75,21.34 31,22.09 MCU.7 25.63,22.09 25.23,22.48 23.37,22.48 22.23,23.62 20.45,23.62 19.81,22.99 19.3,22.99 | 33.02,21.72 v33.02,21.34 | 40.27,34.94 36.56,34.94 34.92,36.58 34.92,38.61 35.56,39.24 v35.56,39.37 36.58,38.86 MPU9150.3 | v14.73,25.53 15.24,25.02 18.29,25.02 19.3,24 19.3,22.99 | 19.3,22.99 19.68,22.61 C7.2 | 22.35,28.96 23.5,27.81 25.4,27.81 26.92,26.29 28.32,26.29 33.02,21.59 | 45.57,37.36 44.05,37.36
  Top 0.406: C1.1 17.74,10.08 PMIC1.2 15.94,8.4 | 33.77,20.59 v33.02,21.34 33.02,21.59 | JPOWER.2 19.05,2.67 17.65,4.06 15.24,4.06 14.48,4.83 14.48,7.75 15.11,8.38 15.84,8.38 L2.1 | v22.1,28.96 22.35,28.96
  Bottom 0.305: 32.77,21.34 v33.02,21.34 14.73,21.34 11.81,18.41 11.81,14.61 14.48,11.94 v18.03,11.94 | v4.95,25.53 v14.73,25.53
  Bottom 0.406: v22.1,28.96 18.41,28.96 16.64,30.73 16.64,32.64 22.1,37.97 24.51,37.97 27.3,40.77 | 27.3,40.77 v27.3,45.47 | v35.56,39.37 34.16,40.77 27.3,40.77
3.3V-BLE
  Top 0.203: C26.1 2.88,35.26 2.79,35.35 | C25.1 10.99,32.93 BLE112-A.VDD_USB | R9.2 Q1.2
  Top 0.406: BLE112-A.AVDD1 2.79,35.35 BLE112-A.AVDD2 3.49,37.15 3.94,37.59 10.92,37.59 | 18.29,44.45 16.64,44.45 15.88,43.69 15.88,42.55 10.92,37.59 | 18.29,44.45 20.66,44.45 C24.1 23.18,44.62 Q1.2 | BLE112-A.DVDD 18.24,44.5 18.29,44.45 | BLE112-A.VDD_USB 10.92,35.42 10.92,37.59
5V  (via drill 0.6, 0.7)
  Top 0.203: MCU.45 40.01,23.59 C10.2
  Top 0.305: MCU.52 35.27,25.31 v35.94,24.64 36.99,23.59 MCU.45 | v29.21,19.3 28.7,18.8 28.7,15.88 26.04,13.21 23.11,13.21 22.48,12.57
  Top 0.406: PMIC1.3 16.05,13.21 20.07,13.21 21,12.28 PMIC2.3 21.08,12.19 v22.48,12.19 22.48,12.57 | 14.99,12.7 PMIC1.3 | PMIC1.3 14.56,12.7 11.81,12.7 11.98,13.12 11.98,12.28 C14.1 9.92,12.82 L1.1 9.54,15.7 C23.1
  Bottom 0.305: v29.21,19.3 33.66,19.3 34.8,20.45 34.8,23.5 v35.94,24.64
  Bottom 0.406: JPOWER.6 29.21,5.08 27.69,6.6 24.89,6.6 22.48,9.02 v22.48,12.19
ADCH0
  Top 0.203: MCU.28 34.77,14.38 35.31,13.84 36.45,13.84 38.86,11.43 40.13,11.43 40.51,11.05 40.51,8 40.26,7.75 36.45,7.75 35.31,6.6 35.31,3.56 JAD.1
ADCH1
  Top 0.203: MCU.29 35.27,14.64 35.56,14.35 36.7,14.35 39.12,11.94 40.39,11.94 41.02,11.3 41.02,7.75 40.51,7.24 36.7,7.24 35.81,6.35 35.81,3.56 JAD.2
ADCH2  (via drill 0.38)
  Top 0.203: MCU.30 35.77,16.72 36.32,17.27 37.47,17.27 37.85,16.89 37.85,15.24 39.62,13.46 41.02,13.46 43.05,11.56 v43.05,10.79
  Bottom 0.203: v43.05,10.79 43.05,9.91 39.37,6.22 JAD.3
ADCH3  (via drill 0.38)
  Top 0.203: MCU.31 36.27,16.59 36.45,16.76 37.21,16.76 37.34,16.64 37.34,15.11 39.5,12.95 40.89,12.95 42.04,11.81 42.04,8.64 v42.67,8
  Bottom 0.203: v42.67,8 42.67,3.3 JAD.4
ADCH4
  Top 0.203: MCU.32 36.77,15.05 39.37,12.45 40.64,12.45 41.53,11.56 41.53,7.24 44.45,4.32 JAD.5
ADCH5
  Top 0.203: MCU.33 38.35,17.17 38.35,15.37 39.75,13.97 41.27,13.97 44.7,10.54 44.7,5.97 46.99,3.68 JAD.6
BLE-P1_0
  Top 0.203: BLE112-A.P1_0 19.97,42 20.7,41.27 20.7,39.24 21.84,38.1 R10.1
BLE-RST  (via drill 0.38)
  Top 0.203: SJ1.1 24.89,41.06 R9.1 v24.89,42.67 | BLE112-A.RESET 7.24,46.1 8.76,44.58 8.76,43.31 10.41,41.53 v13.21,41.53
  Bottom 0.203: v13.21,41.53 23.75,41.53 v24.89,42.67
BLE-USB+  (via drill 0.38)
  Top 0.203: BLE112-A.USB+ 13.46,35.32 13.46,33.78 15.37,31.88 v17.78,31.88 | R10.2 24.98,37.55 24.26,36.83 21.34,36.83 20.32,35.81 v20.32,34.67
  Bottom 0.203: JP2.1 39.62,33.15 39.62,33.66 37.85,35.43 31.37,35.43 29.84,33.91 28.07,33.91 24.89,30.73 23.75,30.73 22.61,31.88 v17.78,31.88 17.78,32.89 19.68,34.67 v20.32,34.67
BLE-USB-  (via drill 0.38)
  Top 0.203: BLE112-A.USB- 14.73,33.66 15.49,32.89 v19.05,32.89
  Bottom 0.203: JP1.1 37.97,35.94 31.24,35.94 29.72,34.42 27.81,34.42 24.64,31.24 24,31.24 22.86,32.38 19.56,32.38 v19.05,32.89
GND  (via drill 0.5, 0.6, 0.7)
  Top 0.203: MCU.8 25.28,21.59 | MCU.56 33.27,28.07 32.77,28.57 32.77,30.23 33.62,31.08 C5.1 | 25.28,21.59 24.89,21.97 22.48,21.97 21.84,22.61 C7.1 | MPU9150.18 MPU9150.17 44.07,39.36 | 44.07,39.36 45.57,39.36 C20.1 | MPU9150.15 43.82,38.36 44.07,38.61 44.07,39.36 | 25.28,21.59
  Top 0.254: MCU.22 31.77,14.24 v31.24,13.72
  Top 0.406: USB.GND 5.09,9.18 USB.GND3 | USB.GND3 2.74,8.68 USB.GND4 | USB.GND1 4.14,14.13 USB.GND2 5.71,13.68 C23.2 7.87,15.66 | C14.2 11.43,15.49 | IP4220CZ6.2 4.8,8.89 USB.GND3
  other vias: 20.19,8.51 19.68,6.6 8.76,5.59 10.03,6.1 13.34,11.43 13.21,29.21 4.7,40.64 3.3,40.64 1.91,40.64 4.06,39.12 2.67,39.12 6.1,42.04 6.1,43.43 6.1,44.83 7.62,44.07 7.62,42.67 6.1,40.64 7.62,41.27 5.46,39.12 37.08,5.97 41.27,5.97 48.51,39.37 37.47,40.77 21.59,35.56 27.43,16.38 21.08,14.1 32.77,23.24 29.59,23.24 36.7,21.97 35.56,19.43 30.1,17.53 18.8,27.3 28.07,13.59 21.97,39.5 29.34,32 17.78,35.31 14.73,38.86 24.38,17.65 35.69,8.51 6.35,7.87 32.26,31.11 43.69,42.93 45.72,9.91 45.72,7.87 44.83,18.03 44.7,26.16 44.58,39.12 43.43,36.2 35.94,37.47 37.97,46.48 38.99,48.26 51.05,32.64 21.97,22.35 13.97,17.91 15.62,17.91 7.11,20.57 7.11,18.29 8.38,19.43 5.84,19.43 4.95,27.81 6.99,32.26 15.75,23.88 19.05,47.24 17.65,47.24 34.92,48.13 13.72,44.07 27.43,27.43 22.1,30.73 22.61,15.88 25.53,33.91 24.51,32.89 29.21,35.43 30.23,48.51 45.34,48.64 42.8,48.64 43.81,9.02 13.97,16 24.13,4.95 26.16,4.95 29.97,7.62 32,4.57 44.83,21.59 43.69,29.08 32,3.05
  pour Bottom (isolate 0.254): 5.33,53.34 49.53,53.34 49.53,40.39 52.07,37.85 52.07,5.08 49.53,2.54 49.53,0 0,0 0,41.4 5.33,41.4
  pour Top (isolate 0.254): 5.33,53.34 49.53,53.34 49.53,40.39 52.07,37.85 52.07,5.08 49.53,2.54 49.53,0 0,0 0,41.4 5.33,41.4
HFXTAL_N
  Top 0.203: MCU.25 33.27,12.67 X1.P$2 35.02,9.45 C15.1
HFXTAL_P
  Top 0.203: MCU.24 32.77,12.67 X1.P$1 31.02,9.45 C16.1
I2C0_SCL  (via drill 0.38)
  Top 0.203: R8.1 40.27,43.66 MPU9150.23 40.27,39 v40.26,38.35 | MCU.2 26.21,24.59 24.64,26.16 24,26.16 22.99,25.15 20.57,25.15 19.94,25.78 19.94,27.81 19.05,28.7 19.05,31.37 v23.37,35.69
  Bottom 0.203: v40.26,38.35 40.26,36.83 39.75,36.45 24.13,36.45 v23.37,35.69
I2C0_SDA  (via drill 0.38)
  Top 0.203: MCU.1 26.48,25.09 24.89,26.67 23.75,26.67 22.73,25.65 20.83,25.65 20.45,26.04 20.45,28.07 19.56,28.96 19.56,30.48 26.04,36.96 26.04,40.64 v28.96,43.56 | MPU9150.24 39.77,42.4 v38.61,43.56 38.61,44.28 R7.1
  Bottom 0.203: v28.96,43.56 v38.61,43.56
IO2  (via drill 0.38)
  Top 0.203: MCU.44 40.36,23.09 41.15,23.88 45.47,23.88 JEX.12 45.59,26.8 45.59,29.21 44.7,30.1 v44.7,31.75
  Bottom 0.203: JIOL.3 47.37,45.34 47.37,41.15 45.59,39.37 45.59,33.78 44.7,32.89 v44.7,31.75
IO3  (via drill 0.38)
  Top 0.203: MCU.43 40.62,22.59 41.15,23.11 46.74,23.11 JEX.10 JEX.9 50.93,24.26 50.93,31.24 50.29,31.88 47.75,31.88 46.74,32.89 46.74,36.45 46.99,36.7 46.99,37.08 47.24,37.34 47.24,41.02 v46.35,41.91
  Bottom 0.203: JIOL.4 46.86,43.31 46.86,42.42 v46.35,41.91
IO4
  Top 0.203: MCU.51 35.77,28.28 36.2,28.7 36.83,28.7 37.59,29.46 37.59,31.62 34.42,34.8 34.42,40.89 36.96,43.43 36.96,50.67 JIOL.5
IO5
  Top 0.203: MCU.54 34.27,28.17 34.92,28.83 34.92,33.53 33.91,34.54 33.91,41.15 36.45,43.69 36.45,48.64 JIOL.6
IO6  (via drill 0.38)
  Top 0.203: MCU.63 29.77,28.02 28.07,29.72 28.07,36.45 v29.21,37.47 | v32.89,37.47 33.4,37.97 33.4,41.4 35.56,43.56 35.56,45.59 31.75,49.4 JIOL.7
  Bottom 0.203: v29.21,37.47 v32.89,37.47
IO7  (via drill 0.38)
  Top 0.203: MCU.64 27.56,28.8 27.56,38.73 v28.32,39.5 | v32.26,39.62 32.89,40.26 32.89,41.66 35.05,43.81 35.05,45.34 29.59,50.8 JIOL.8
  Bottom 0.203: v28.32,39.5 28.45,39.62 v32.26,39.62
IO8  (via drill 0.38)
  Top 0.203: MCU.4 26.32,23.59 25.78,24.13 25.15,24.13 v24.38,24.89 | JIOH.1 25.15,50.16 28.83,46.48 28.83,45.34 29.97,44.2 29.97,41.53 29.34,40.89 27.81,40.89 27.05,40.13 27.05,29.84 v26.42,29.21
  Bottom 0.203: v24.38,24.89 24.38,26.67 25.53,27.81 25.53,28.32 v26.42,29.21
IO9  (via drill 0.38)
  Top 0.203: MCU.5 26.06,23.09 25.53,23.62 24,23.62 22.99,24.64 20.32,24.64 18.8,26.16 17.65,26.16 v17.02,26.8 | v25.65,46.99 25.65,47.75 JIOH.2
  Bottom 0.203: v17.02,26.8 15.62,28.19 15.62,35.56 20.57,40.51 24.89,40.51 26.42,42.04 26.42,43.56 25.65,44.32 v25.65,46.99
IO10  (via drill 0.38)
  Top 0.203: v15.11,27.05 16.51,25.65 18.54,25.65 20.07,24.13 22.61,24.13 23.62,23.11 25.4,23.11 25.93,22.59 MCU.6 | v20.7,47.88 21.21,47.88 22.61,46.48 23.22,46.48 Q1.1
  Bottom 0.203: v15.11,27.05 15.11,35.81 20.32,41.02 24.64,41.02 25.91,42.29 25.91,43.18 25.27,43.81 21.72,43.81 20.7,44.83 v20.7,47.88
LEU1_RX  (via drill 0.38)
  Top 0.203: MCU.38 37.61,20.09 37.08,19.56 37.08,18.8 v36.7,18.41
  Bottom 0.203: v36.7,18.41 38.61,20.32 JEX.8
LEU1_TX
  Top 0.203: MCU.37 40.87,19.59 41.78,18.67 41.78,15.49 42.16,15.11 44.32,15.11 JEX.6
LFXTAL_N
  Top 0.203: MCU.16 26.48,17.59 26.29,17.4 26.29,15.24 25.53,14.48 24.97,14.48 Y1.X1 22.23,14.61 21.46,15.37 20.83,15.37 19.01,17.18 C18.1
LFXTAL_P
  Top 0.178: Y1.X2 24.77,15.88 23.11,17.53 22.69,17.53 C17.1
  Top 0.203: MCU.15 26.21,18.09 24.26,16.13 24.59,16.13 Y1.X2
M_USB_DM  (via drill 0.38)
  Top 0.203: MCU.47 39.7,24.59 40.26,25.15 40.26,28.19 v41.27,29.21
  Bottom 0.203: v41.27,29.21 41.27,30.73 JP1.3
M_USB_DP  (via drill 0.38)
  Top 0.203: MCU.48 39.53,25.82 39.53,28.79 v39.5,28.83
  Bottom 0.203: v39.5,28.83 39.5,30.48 JP2.3
M_USB_ID  (via drill 0.38)
  Top 0.203: MCU.53 34.77,28.04 v36.45,29.72
  Bottom 0.203: v36.45,29.72 36.83,30.1 SJ2.1
N$4  (via drill 0.6)
  Top 0.406: L2.2 v15.88,5.46 | v22.1,5.46 R6.1
  Bottom 0.406: v15.88,5.46 v22.1,5.46
N$6
  Top 0.203: S1.A1 7.51,3.94 11.18,3.94 11.98,3.14 R1.2
N$7
  Top 0.178: C4.1 40.81,21.09 MCU.40
N$8
  Top 0.203: MCU.46 39.83,24.09 40.77,25.02 40.77,26.38 C9.2
N$9
  Top 0.203: R5.1 46.06,45.34 48.01,45.34 48.48,44.87 S2.B3
N$12
  Top 0.203: MPU9150.10 41.27,35.6 C21.2
N$13
  Top 0.203: 10.59,7.87 IP4220CZ6.4 9.86,7.95 9.4,7.49 | USB.D+ 6.1,11.18 6.35,10.92 8.51,10.92 9.4,10.03 9.4,7.49 | 9.23,7.33 9.4,7.49
  Top 0.254: 9.23,7.33 9.02,7.11 7.87,7.11 7.2,6.44 R3.2
N$14  (via drill 0.38)
  Top 0.203: USB.D- 6.21,11.83 6.6,11.43 8.64,11.43 10.24,9.83 IP4220CZ6.6 10.74,9.91 v11.94,9.91 | v13.21,7.87 13.21,6.44 R2.2
  Bottom 0.203: v11.94,9.91 13.21,8.64 v13.21,7.87
N$15
  Top 0.203: MPU9150.20 41.77,41.01 41.78,41.02 41.78,41.15 42.04,41.4 42.55,41.4 43.05,40.89 C22.1
PA2  (via drill 0.38)
  Top 0.203: S2.A1 46.5,43.94 R4.2 45.34,43.9 45.34,42.8 44.45,41.91 v41.15,41.91 | MCU.3 28.28,24.09 28.45,24.26 28.45,25.4 28.19,25.65 26.67,25.65 25.15,27.18 23.5,27.18 22.48,26.16 21.08,26.16 20.95,26.29 20.95,28.32 20.07,29.21 20.07,30.23 26.54,36.7 26.54,40.39 28.07,41.91 v28.96,41.91
  Bottom 0.203: v28.96,41.91 v41.15,41.91
PD6  (via drill 0.38)
  Top 0.203: MCU.34 39.95,18.09 40.13,17.91 40.13,16.64 39.88,16.38 v39.37,16.38
  Bottom 0.203: v39.37,16.38 38.48,15.49 38.48,13.97 40.01,12.45 44.83,12.45 45.97,11.3 48.13,11.3 JEX.1
PD7  (via drill 0.38)
  Top 0.203: MCU.35 40.22,18.59 40.64,18.03 40.64,15.62 v40.13,15.11
  Bottom 0.203: v40.13,15.11 41.66,13.59 46.1,13.59 JEX.2
PD8
  Top 0.203: MCU.36 40.48,19.09 41.27,18.29 41.27,15.24 41.91,14.61 46.35,14.61 JEX.4
RESET  (via drill 0.38)
  Top 0.203: MCU.20 30.77,14.64 27.81,11.68 v27.81,11.3 | S1.B3 5.93,1.56 5.46,2.03 5.46,3.94 5.97,4.45 13.34,4.45 13.97,3.81 C3.2 15.91,3.14 JPOWER.1
  Bottom 0.203: JPOWER.1 16.51,1.78 17.14,1.14 29.97,1.14 30.61,1.78 30.61,4.83 27.81,7.62 v27.81,11.3
SWCLK/LEU0_TX_3  (via drill 0.38)
  Top 0.203: MCU.49 36.77,26.09 36.96,25.91 37.59,25.91 v37.97,26.29
  Bottom 0.203: v37.97,26.29 38.99,27.3 46.35,27.3 JEX.14 46.99,28.07 45.59,29.46 45.59,31.24 46.1,31.75 46.1,39.12 47.88,40.89 47.88,47.37 JIOL.2
SWIO/LEU0_RX_3
  Top 0.203: MCU.50 36.27,28.02 36.45,28.19 37.21,28.19 42.42,33.4 44.58,33.4 46.99,30.99 JEX.16
  Bottom 0.203: JIOL.1 48.39,49.4 48.39,40.64 46.61,38.86 46.61,34.29 46.99,33.91 JEX.16
US0_CLK  (via drill 0.38)
  Top 0.203: JIOH.6 13.97,52.32 26.16,52.32 26.67,51.82 26.67,50.55 30.73,46.48 33.02,46.48 34.54,44.96 34.54,44.2 32,41.66 32,40.89 31.11,40.01 31.11,39.37 32,38.48 32,34.92 v33.53,33.4 | MCU.61 30.77,28.03 30.23,28.57 v30.23,29.46
  Bottom 0.203: v30.23,29.46 30.23,30.61 31.88,32.38 33.02,32.38 33.53,32.89 v33.53,33.4
US0_CS  (via drill 0.38)
  Top 0.203: v32,33.4 31.5,33.91 31.5,38.35 30.48,39.37 30.48,40.01 31.5,41.02 31.5,42.67 v33.4,44.58 | MCU.62 30.27,25.74 v30.73,25.27
  Bottom 0.203: JIOH.3 20.07,51.44 20.83,52.2 26.29,52.2 26.54,51.94 26.54,50.67 30.23,46.99 30.99,46.99 v33.4,44.58 | v30.73,25.27 30.86,25.4 30.86,27.94 30.35,28.45 29.84,28.45 29.34,28.96 29.34,30.61 v32,33.4
US0_RX  (via drill 0.38)
  Top 0.203: MCU.60 31.27,29.82 30.48,30.61 30.48,38.1 29.46,39.12 29.46,40.26 30.48,41.27 30.48,44.45 30.23,44.7 v30.23,45.47 | v24.13,47.88 22.1,47.88 21.08,48.9 16.89,48.9 JIOH.5
  Bottom 0.203: v24.13,47.88 28.07,47.88 30.23,45.72 v30.23,45.47
US0_TX  (via drill 0.38)
  Top 0.203: MCU.59 31.77,30.08 30.99,30.86 30.99,38.23 29.97,39.24 29.97,40.13 30.99,41.15 30.99,44.07 v31.75,44.83 | v22.61,48.9 22.1,49.4 18.92,49.4 JIOH.4
  Bottom 0.203: v22.61,48.9 27.69,48.9 30.1,46.48 30.73,46.48 31.75,45.47 v31.75,44.83
US1_RX  (via drill 0.38)
  Top 0.203: MCU.10 24.75,20.59 24.38,20.95 16.13,20.95 11.05,26.04 v11.05,28.19 | v11.05,42.93 11.05,44.58 12.24,45.77 BLE112-A.P0_3
  Bottom 0.203: v11.05,42.93 v11.05,28.19
US1_TX  (via drill 0.38)
  Top 0.203: MCU.9 25.02,21.09 24.64,21.46 16.51,21.46 12.7,25.27 v12.7,27.05 | BLE112-A.P0_2 10.99,45.28 v9.91,44.32
  Bottom 0.203: v12.7,27.05 10.67,27.05 9.91,27.81 v9.91,44.32
US2_CLK
  Top 0.203: MCU.13 23.97,19.09 23.62,19.43 13.84,19.43 10.03,23.24 10.03,25.02 8.35,26.7 U3.5 2.57,26.7 JSER.2
US2_CS
  Top 0.203: 7.51,23.37 8,23.37 9.02,23.37 13.46,18.92 23.37,18.92 23.7,18.59 MCU.14 | 7.51,23.37 U3.2 | JSER.4 2.79,23.37 7.51,23.37
US2_RX
  Top 0.203: MCU.12 24.23,19.59 23.88,19.94 14.1,19.94 10.54,23.5 10.54,25.27 8.64,27.18 8.64,28.32 8.05,28.9 U3.7 3.5,28.9 JSER.1
US2_TX  (via drill 0.38)
  Top 0.203: MCU.11 27.25,20.07 24.51,20.07 24.13,20.45 15.11,20.45 v12.57,22.99 | v9.02,24.51 9.01,24.5 7.62,24.5 | 7.62,24.5 U3.3 3.82,24.5 3.17,25.15 JSER.3 | 7.5,24.38 7.62,24.5
  Bottom 0.203: v12.57,22.99 11.05,24.51 v9.02,24.51
USB_DM  (via drill 0.38)
  Top 0.203: R2.1 11.43,6.18 v11.43,5.33
  Bottom 0.203: v11.43,5.33 11.68,5.08 13.21,5.08 19.43,11.3 19.43,12.57 18.92,13.08 14.1,13.08 12.45,14.73 12.45,18.29 14.99,20.83 31.75,20.83 32.38,20.19 33.66,20.19 34.16,20.7 34.16,25.4 36.58,27.81 42.29,27.81 42.67,28.19 42.67,31.5 42.42,31.75 JP1.2
USB_DP  (via drill 0.38)
  Top 0.203: R3.1 5.33,6.18 v5.33,5.33
  Bottom 0.203: v5.33,5.33 6.1,5.33 8,7.24 8,10.29 11.3,13.59 11.3,18.67 14.73,22.1 20.19,22.1 21.84,23.75 21.84,26.16 22.99,27.3 24.26,27.3 25.02,28.07 25.02,29.34 28.57,32.89 30.1,32.89 31.62,34.42 33.91,34.42 35.05,33.27 35.05,28.83 35.69,28.32 36.96,28.32 38.1,29.46 38.1,31.37 38.48,31.75 JP2.2
USB_ID  (via drill 0.38)
  Top 0.203: 5.84,10.41 5.73,10.53 USB.ID 6.24,10.53 v6.86,9.91 8.05,9.91 IP4220CZ6.1
  Bottom 0.203: 36.58,32.77 SJ2.2 37.72,33.4 37.72,34.04 36.83,34.92 31.5,34.92 29.97,33.4 28.32,33.4 24.51,29.59 24.51,28.32 24,27.81 22.73,27.81 21.34,26.42 21.34,24 19.94,22.61 14.48,22.61 10.79,18.92 10.79,13.84 v6.86,9.91
VDD  (via drill 0.6)
  Top 0.178: 22.03,8.41 R6.2
  Top 0.203: MCU.27 34.29,15.57 34.29,14.1 35.05,13.34 36.2,13.34 38.61,10.92 38.86,10.92 39.28,10.5 C11.1 39.16,10.5
  Top 0.305: PMIC2.2 23.84,10.08 C2.1 C13.1 | C13.1 26.16,12.03 C12.1 | v32.26,17.27 v32.27,17.26 MCU.23 32.27,13.22 31.75,12.7 29.72,12.7 29.21,12.19 29.21,10.16 28.83,9.78 C13.1 | v35.05,17.78 35.05,17.53 34.27,16.74 MCU.27
  Top 0.406: PMIC2.2 22.03,8.41 | JPOWER.3 20.89,3.24 | 20.89,3.24 20.83,3.3 | R6.2 21.8,8.34 20.89,7.43 20.89,3.24
  Bottom 0.305: v32.26,17.27 32.77,17.78 v35.05,17.78

### Text on the board
bPlace: ID | BDP | BDM | MID | MDP | MDM | USB JPs